# EasyEDA Pro project ProPrj_blaster_2025-02-22.epro

# Schematic Schematic1
Board Name: Board1; Create Date: 2025-02-19; Page Name: P1; Project Name: irblasterthingidk; Schematic Name: Schematic1; Update Date: 2025-02-22; Company: EasyEDA.com; Page Size: A4; Version: V1.0
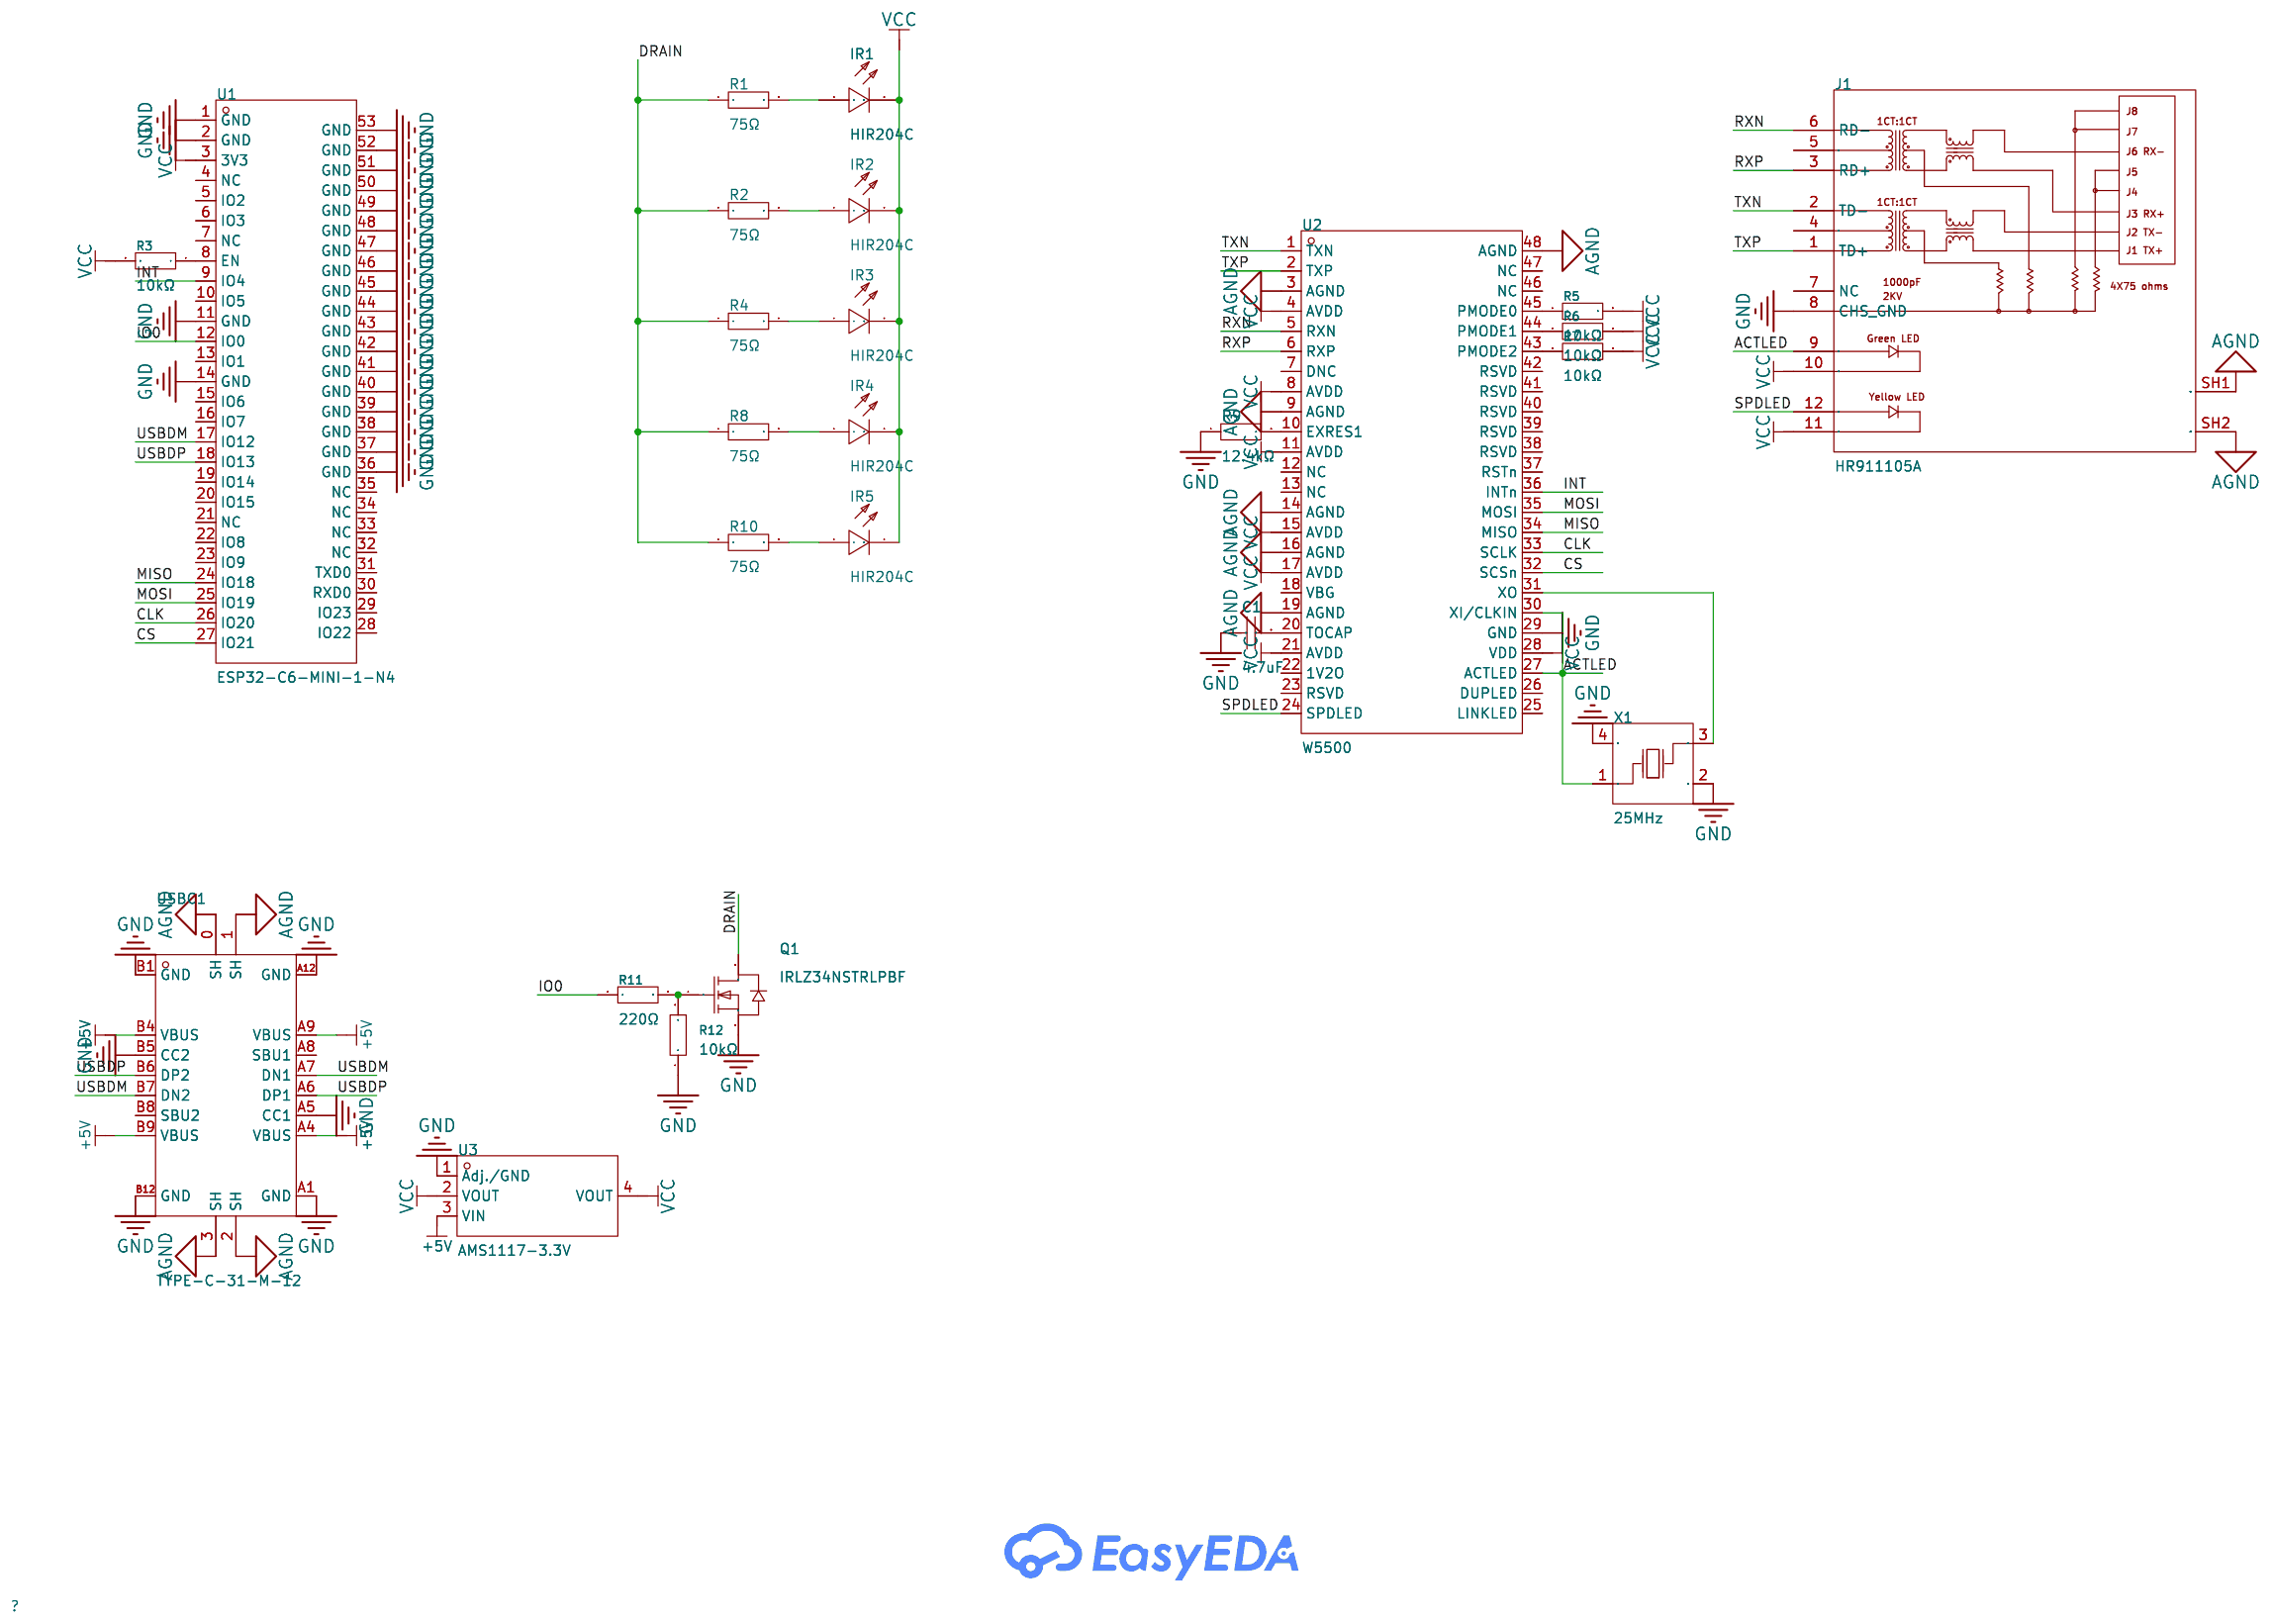
[diagram p0: schematic sheet]

## Parts
C1  4.7uF  [C0805]
IR1  HIR204C  [LED-TH_BD4.2-P2.54-FD]
IR2  HIR204C  [LED-TH_BD4.2-P2.54-FD]
IR3  HIR204C  [LED-TH_BD4.2-P2.54-FD]
IR4  HIR204C  [LED-TH_BD4.2-P2.54-FD]
IR5  HIR204C  [LED-TH_BD4.2-P2.54-FD]
J1  HR911105A  [RJ45-TH_HR911105A]
Q1  IRLZ34NSTRLPBF  [DPAK_L10.2-W9.1-P5.08-LS15.2-BL-CW]
R1  75Ω  [R0603]
R2  75Ω  [R0603]
R3  10kΩ  [R0805]
R4  75Ω  [R0603]
R5  10kΩ  [R0805]
R6  10kΩ  [R0805]
R7  10kΩ  [R0805]
R8  75Ω  [R0603]
R9  12.4kΩ  [R0603]
R10  75Ω  [R0603]
R11  220Ω  [R0603]
R12  10kΩ  [R0805]
U1  ESP32-C6-MINI-1-N4  [WIFIM-SMD_61P-L16.6-W13.2-P0.80-ESP32-C6-MINI-1-N4]
U2  W5500  [LQFP-48_L7.0-W7.0-P0.50-LS9.0-BL]
U3  AMS1117-3.3V  [SOT-223-3_L6.5-W3.4-P2.30-LS7.0-BR]
USBC1  TYPE-C-31-M-12  [USB-C_SMD-TYPE-C-31-M-12]
X1  25MHz  [CRYSTAL-SMD_4P-L3.2-W2.5-BL]

## Library data of the parts
C1 = CL21A475KAQNNNE: Capacitance: Tolerance:±10% Tolerance:±10% Voltage Rated: Temperature Coefficient:; LCSC Part Name: 4.7uF ±10% 25V; Supplier Part: C1779; Manufacturer: SAMSUNG(三星); Supplier Footprint: 0805; JLCPCB Part Class: Basic Part; Datasheet: https://atta.szlcsc.com/upload/public/pdf/source/20160218/1457707763339.pdf; Supplier: LCSC; Tolerance: ±10%
IR1-IR5 = HIR204C: Vf - Forward Voltage:1.45V Vf - Forward Voltage:1.45V Wavelength:850nm Wavelength:850nm Radiant Intensity: View Angle:25° Operating Temperature:-40℃~+85℃ Operating Temperature:-40℃~+85℃; LCSC Part Name: HIR204C 3mm 850nm R档; Supplier Part: C5118; Manufacturer: EVERLIGHT(亿光); Supplier Footprint: 插件,D=3mm; JLCPCB Part Class: Extended Part; Datasheet: https://atta.szlcsc.com/upload/public/pdf/source/20170228/1488267637610.pdf; Supplier: LCSC; Vf - Forward Voltage: 1.45V; Wavelength: 850nm; View Angle: 25°; Operating Temperature: -40℃~+85℃
J1 = HR911105A_C12074: Connector Type:RJ45Receptacle Mounting Style:- Number of Ports:1 LED:WithLED Shielding:- Ratings:- PoE:Without PoE Supplementary Features:With filtering Contact Material:- Contact Plating:- Operating Temperature Range:- Operating Temperature Range:-; LCSC Part Name: 带LED; Supplier Part: C12074; Manufacturer: HANRUN(汉仁); Supplier Footprint: 插件; JLCPCB Part Class: Extended Part; Datasheet: https://atta.szlcsc.com/upload/public/pdf/source/20170918/C12074_1505726819496976146.pdf; Supplier: LCSC; Connector Type: RJ45Receptacle; Number of Ports: 1; LED: WithLED; PoE: Without PoE; Supplementary Features: With filtering
Q1 = IRLZ34NSTRLPBF: Type:1 N-Channel Drain Source Voltage (Vdss): Continuous Drain Current (Id): Drain Source On Resistance (RDS(on)@Vgs,Id):0.035Ω@10V,16A Power Dissipation (Pd): Gate Threshold Voltage (Vgs(th)@Id):1V@250uA Total Gate Charge (Qg@Vgs):25nC Input Capacitance; LCSC Part Name: 1个N沟道 耐压:55V 电流:30A; Supplier Part: C538198; Manufacturer: Infineon(英飞凌); Supplier Footprint: D2PAk; JLCPCB Part Class: Extended Part; Datasheet: https://atta.szlcsc.com/upload/public/pdf/source/20240415/AB964699F0EAA32D992C9FC2B4E5BADE.pdf; Supplier: LCSC; Type: 1 N-Channel; Drain Source On Resistance (RDS(on)@Vgs,Id): 0.035Ω@10V,16A; Gate Threshold Voltage (Vgs(th)@Id): 1V@250uA; Total Gate Charge (Qg@Vgs): 25nC; Input Capacitance (Ciss@Vds): 880pF; Reverse Transfer Capacitance (Crss@Vds): 94pF; Operating Temperature: -55℃~+175℃
R1 R2 R4 R8 R10 = 0603WAF750JT5E: Type:Thick Film Resistors Resistance:75Ω Tolerance:±1% Tolerance:±1% Power(Watts): Overload Voltage (Max): Temperature Coefficient:±200ppm/℃ Temperature Coefficient:±200ppm/℃ Operating Temperature Range:-55℃~+155℃ Operating Temperature Range:-55℃~+155℃; LCSC Part Name: 75Ω ±1% 100mW 厚膜电阻; Supplier Part: C4275; Manufacturer: UNI-ROYAL(厚声); Supplier Footprint: 0603; JLCPCB Part Class: Basic Part; Datasheet: https://atta.szlcsc.com/upload/public/pdf/source/20200306/C422600_1E6D84923E4A46A82E41ADD87F860B5C.pdf; Supplier: LCSC; Type: Thick Film Resistors; Tolerance: ±1%; Temperature Coefficient: ±200ppm/℃; Operating Temperature Range: -55℃~+155℃
R3 R5-R7 R12 = 0805W8F1002T5E: Type:Thick Film Resistors Resistance:10kΩ Tolerance:±1% Tolerance:±1% Power(Watts): Overload Voltage (Max): Temperature Coefficient:±100ppm/℃ Temperature Coefficient:±100ppm/℃ Operating Temperature Range:-55℃~+155℃ Operating Temperature Range:-55℃~+155℃; LCSC Part Name: 10kΩ ±1% 125mW 厚膜电阻; Supplier Part: C17414; Manufacturer: UNI-ROYAL(厚声); Supplier Footprint: 0805; JLCPCB Part Class: Basic Part; Datasheet: https://atta.szlcsc.com/upload/public/pdf/source/20200306/C422600_1E6D84923E4A46A82E41ADD87F860B5C.pdf; Supplier: LCSC; Type: Thick Film Resistors; Tolerance: ±1%; Temperature Coefficient: ±100ppm/℃; Operating Temperature Range: -55℃~+155℃
R9 = 0603WAF1242T5E: Type:Thick Film Resistors Resistance:12.4kΩ Tolerance:±1% Tolerance:±1% Power(Watts): Overload Voltage (Max): Temperature Coefficient:±100ppm/℃ Temperature Coefficient:±100ppm/℃ Operating Temperature Range:-55℃~+155℃ Operating Temperature Range:-55℃~+155℃; LCSC Part Name: 12.4kΩ ±1% 100mW 厚膜电阻; Supplier Part: C22865; Manufacturer: UNI-ROYAL(厚声); Supplier Footprint: 0603; JLCPCB Part Class: Extended Part; Datasheet: https://atta.szlcsc.com/upload/public/pdf/source/20200306/C422600_1E6D84923E4A46A82E41ADD87F860B5C.pdf; Supplier: LCSC; Type: Thick Film Resistors; Tolerance: ±1%; Temperature Coefficient: ±100ppm/℃; Operating Temperature Range: -55℃~+155℃
R11 = 0603WAF2200T5E: Type:Thick Film Resistors Resistance: Tolerance:±1% Tolerance:±1% Power(Watts): Overload Voltage (Max): Temperature Coefficient:±100ppm/℃ Temperature Coefficient:±100ppm/℃ Operating Temperature Range:-55℃~+155℃ Operating Temperature Range:-55℃~+155℃; LCSC Part Name: 220Ω ±1% 100mW 厚膜电阻; Supplier Part: C22962; Manufacturer: UNI-ROYAL(厚声); Supplier Footprint: 0603; JLCPCB Part Class: Basic Part; Datasheet: https://atta.szlcsc.com/upload/public/pdf/source/20200306/C422600_1E6D84923E4A46A82E41ADD87F860B5C.pdf; Supplier: LCSC; Type: Thick Film Resistors; Tolerance: ±1%; Temperature Coefficient: ±100ppm/℃; Operating Temperature Range: -55℃~+155℃
U1 = ESP32-C6-MINI-1-N4: Supplier Part: C5736265; Manufacturer: ESPRESSIF(乐鑫); Supplier Footprint: SMD-53P; JLCPCB Part Class: Extended Part; Datasheet: https://atta.szlcsc.com/upload/public/pdf/source/20240130/4529D418EFEC832950EB8101798FAED6.pdf; Supplier: LCSC
U2 = W5500: channel:8 IO Type:SPI Supply Voltage:3.3V Supply Voltage:3.3V Supply Current:132mA Operating Temperature  range:-40℃~+85℃ Operating Temperature  range:-40℃~+85℃; LCSC Part Name: W5500硬连线TCP/IP嵌入式以太网控制器; Supplier Part: C32843; Manufacturer: WIZNET; Supplier Footprint: LQFP-48(7x7); JLCPCB Part Class: Extended Part; Datasheet: https://atta.szlcsc.com/upload/public/pdf/source/20230714/E10C32B058E0BA54FCE1C1556BE10C07.pdf; Supplier: LCSC; channel: 8; IO Type: SPI; Supply Voltage: 3.3V; Supply Current: 132mA; Operating Temperature  range: -40℃~+85℃
U3 = AMS1117-3.3V_C17702043: Output Type:Fixed Maximum Input Voltage:12V Output Voltage:3.3V Output Voltage:3.3V Output Current:1A; LCSC Part Name: 输入12V 输出3.3V 1A; Supplier Part: C17702043; Manufacturer: HXY MOSFET(华轩阳电子); Supplier Footprint: SOT-223; JLCPCB Part Class: Extended Part; Datasheet: https://atta.szlcsc.com/upload/public/pdf/source/20230912/D3384878F5C576B1BC7138E74285AA14.pdf; Supplier: LCSC; Output Type: Fixed; Maximum Input Voltage: 12V; Output Voltage: 3.3V; Output Current: 1A
USBC1 = TYPE-C-31-M-12: Connector Type:Type-C Standard:- Gender:Female Mounting Style:- Number of Contacts:16P Number of Ports:1 Current Rating - Power (Max):5A Operating Temperature Range:- Operating Temperature Range:-; LCSC Part Name: Type-C 母; Supplier Part: C165948; Manufacturer: 韩国韩荣; Supplier Footprint: SMD; JLCPCB Part Class: Extended Part; Datasheet: https://atta.szlcsc.com/upload/public/pdf/source/20220525/466408E853115E789EDB0DDC29077C05.pdf; Supplier: LCSC; Connector Type: Type-C; Gender: Female; Number of Contacts: 16P; Number of Ports: 1; Current Rating - Power (Max): 5A
X1 = X322525MOB4SI: Crystal Type:Surface Mount Crystal Frequency: Normal temperature Frequency Tolerance:±10ppm Normal temperature Frequency Tolerance:±10ppm Load Capacitor: Frequency Stability(Full temperature range):±20ppm Frequency Stability(Full temperature range):±20ppm; LCSC Part Name: 25MHz ±10ppm 12pF; Supplier Part: C9006; Manufacturer: YXC(扬兴晶振); Supplier Footprint: SMD3225-4P; JLCPCB Part Class: Basic Part; Datasheet: https://atta.szlcsc.com/upload/public/pdf/source/20240329/19D5F850207469550BEB00D7DFEDBC7A.pdf; Supplier: LCSC; Crystal Type: Surface Mount Crystal; Normal temperature Frequency Tolerance: ±10ppm; Frequency Stability(Full temperature range): ±20ppm

## Nets
+5V: U3.3(VIN) USBC1.A4(VBUS) USBC1.A9(VBUS) USBC1.B4(VBUS) USBC1.B9(VBUS)
AGND: J1.SH1 J1.SH2 U2.3(AGND) U2.9(AGND) U2.14(AGND) U2.16(AGND) U2.19(AGND) U2.48(AGND) USBC1.0(SH) USBC1.1(SH) USBC1.2(SH) USBC1.3(SH)
GND: C1.1 J1.8(CHS GND) Q1.3(S) R9.1 R12.1 U1.1(GND) U1.2(GND) U1.11(GND) U1.14(GND) U1.36(GND) U1.37(GND) U1.38(GND) U1.39(GND) U1.40(GND) U1.41(GND) U1.42(GND) U1.43(GND) U1.44(GND) U1.45(GND) U1.46(GND) U1.47(GND) U1.48(GND) U1.49(GND) U1.50(GND) U1.51(GND) U1.52(GND) U1.53(GND) U2.29(GND) U3.1(Adj./GND) USBC1.A1(GND) USBC1.A5(CC1) USBC1.A12(GND) USBC1.B1(GND) USBC1.B5(CC2) USBC1.B12(GND) X1.2(GND) X1.4(GND)
VCC: IR1.2(C) IR2.2(C) IR3.2(C) IR4.2(C) IR5.2(C) J1.10 J1.11 R3.2 R5.2 R6.2 R7.2 U1.3(3V3) U2.4(AVDD) U2.8(AVDD) U2.11(AVDD) U2.15(AVDD) U2.17(AVDD) U2.21(AVDD) U2.28(VDD) U3.2(VOUT) U3.4(VOUT)
ACTLED: J1.9 U2.27(ACTLED)
CLK: U1.26(IO20) U2.33(SCLK)
CS: U1.27(IO21) U2.32(SCSn)
DRAIN: Q1.2(D) R1.1 R2.1 R4.1 R8.1 R10.1
INT: U1.9(IO4) U2.36(INTn)
IO0: R11.1 U1.12(IO0)
MISO: U1.24(IO18) U2.34(MISO)
MOSI: U1.25(IO19) U2.35(MOSI)
RXN: J1.6(RD-) U2.5(RXN)
RXP: J1.3(RD+) U2.6(RXP)
SPDLED: J1.12 U2.24(SPDLED)
TXN: J1.2(TD-) U2.1(TXN)
TXP: J1.1(TD+) U2.2(TXP)
USBDM: U1.17(IO12) USBC1.A7(DN1) USBC1.B7(DN2)
USBDP: U1.18(IO13) USBC1.A6(DP1) USBC1.B6(DP2)
$1N1656: C1.2 U2.20(TOCAP)
$1N1729: R9.2 U2.10(EXRES1)
$1N1975: U2.31(XO) X1.3(OSC2)
$1N1980: U2.30(XI/CLKIN) X1.1(OSC1)
$1N2898: R5.1 U2.45(PMODE0)
$1N2937: R6.1 U2.44(PMODE1)
$1N2976: R7.1 U2.43(PMODE2)
$1N3133: R3.1 U1.8(EN)
$1N4218: Q1.1(G) R11.2 R12.2
$1N5126: IR1.1(A) R1.2
$1N5129: IR2.1(A) R2.2
$1N5132: IR3.1(A) R4.2
$1N5135: IR4.1(A) R8.2
$1N5138: IR5.1(A) R10.2

Not connected (* = marked no-connect by the designer): J1 4 5 7(NC); U1 4(NC) 5(IO2) 6(IO3) 7(NC) 10(IO5) 13(IO1) 15(IO6) 16(IO7) 19(IO14) 20(IO15) 21(NC) 22(IO8) 23(IO9) 28(IO22) 29(IO23) 30(RXD0) 31(TXD0) 32(NC) 33(NC) 34(NC) 35(NC); U2 7(DNC) 12(NC) 13(NC) 18(VBG) 22(1V2O) 23(RSVD) 25(LINKLED) 26(DUPLED) 37(RSTn) 38(RSVD) 39(RSVD) 40(RSVD) 41(RSVD) 42(RSVD) 46(NC) 47(NC); USBC1 A8(SBU1) B8(SBU2)

# Board PCB1
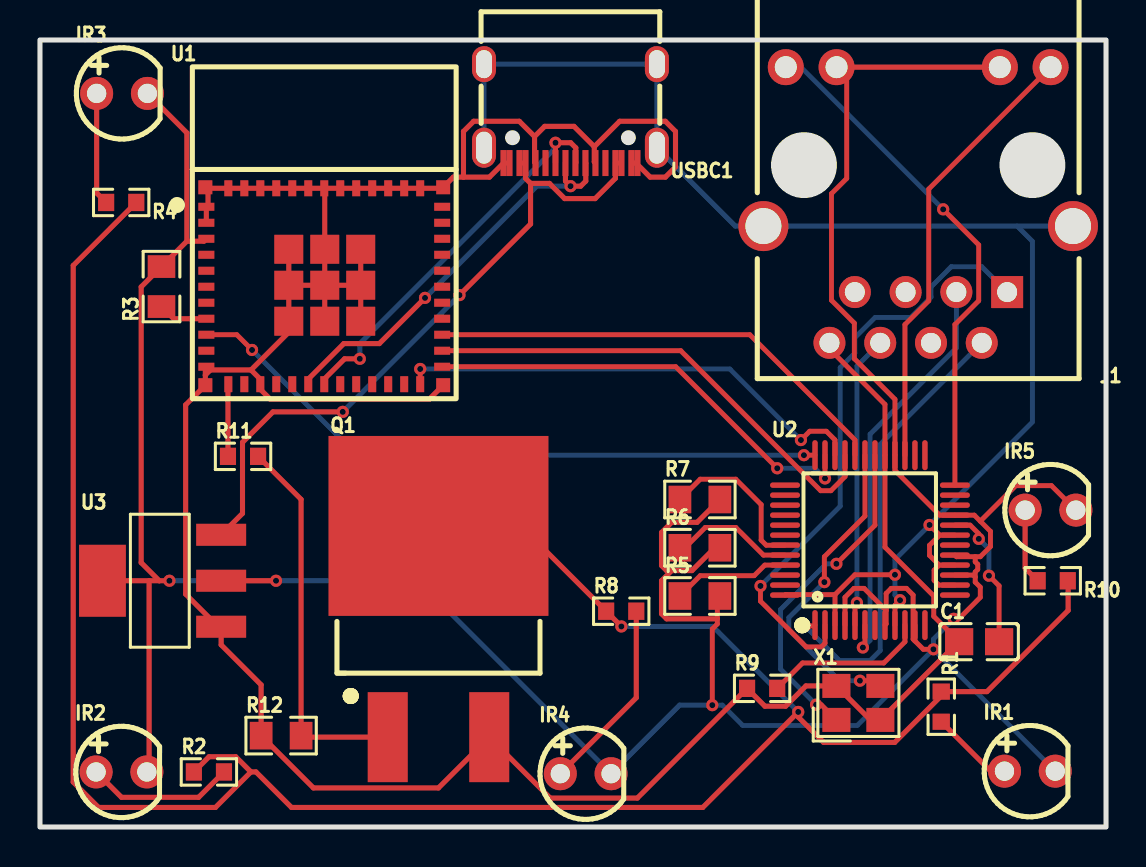
[diagram p1: board, top side]
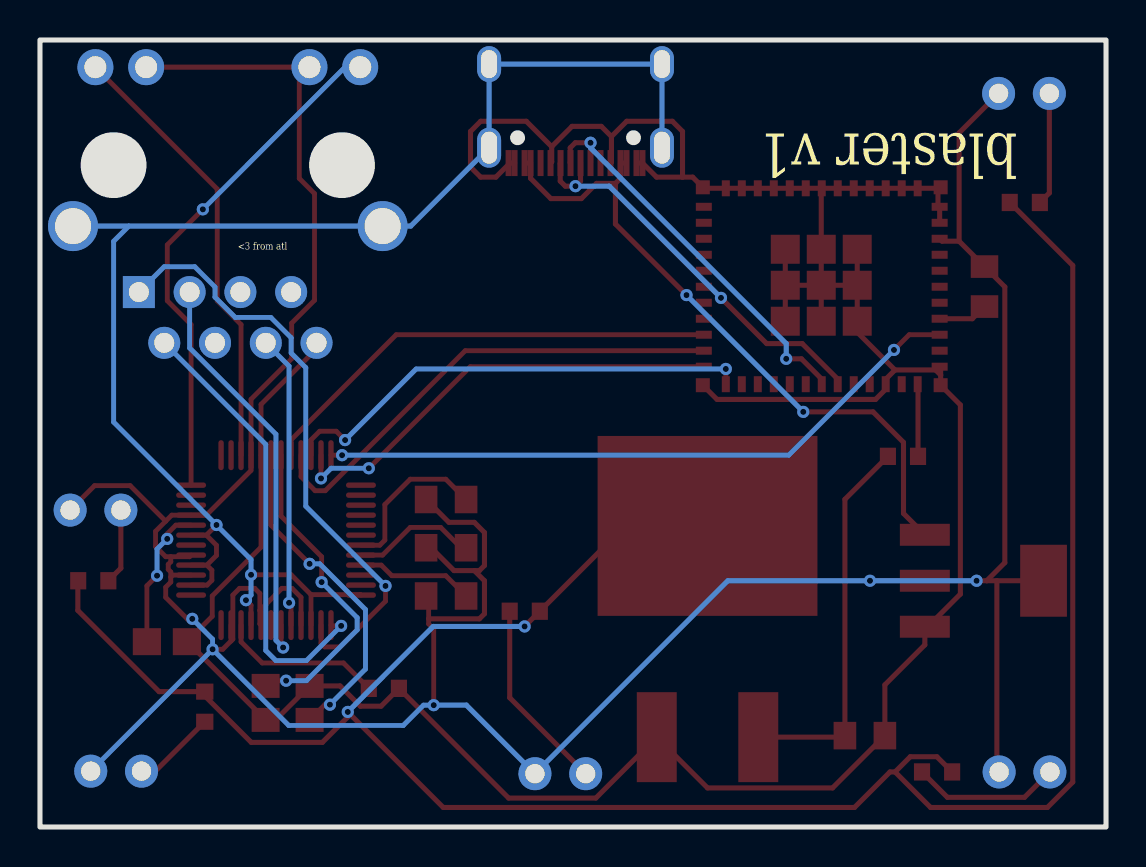
[diagram p2: board, bottom side, seen from below]

Outline 53.34 x 39.37 mm; copper layers: Top Layer, Inner1, Inner2, Bottom Layer. Coordinates in mm from the lower left corner of the outline.
Outline path: rectangle 0,39.37 53.34,0
Stack: Top Layer 0.035mm Outer layer thickness 1oz / Dielectric1 0.2104mm 7628 RC49% 8.6mil / Inner1 0.0152mm Inner layer thickness / Dielectric2 1.065mm 1.1mm H/HOZ Copper / Inner2 0.0152mm Inner layer thickness / Dielectric3 0.2104mm 7628 RC49% 8.6mil / Bottom Layer 0.035mm Outer layer thickness 1oz

## Design rules (mm)
template: JLCPCB Capability(Two Layers Board)
spacing copperThickness1oz (default): track to track 0.102, other pairs 0.152 to 0.3
spacing copperThickness2oz: track to track 0.203, other pairs 0.152 to 0.3
track width copperThickness1oz (default): min 0.127, default 0.254, max 2.54
track width copperThickness2oz: min 0.203, default 0.254, max 2.54
differential pair differentialPair (default): width min 0.127, default 0.254, max 2.54; gap min 0.152, default 0.152
via viaSize (default): diameter min 0.5, default 0.61, max 10; hole min 0.3, default 0.305, max 6.3

## Placement (name value [footprint] x y rotation side)
C1  4.7uF  [C0805]  46.99 9.27 0 top
IR1  HIR204C  [LED-TH_BD4.2-P2.54-FD]  49.53 2.79 0 top
IR2  HIR204C  [LED-TH_BD4.2-P2.54-FD]  4.08 2.75 0 top
IR3  HIR204C  [LED-TH_BD4.2-P2.54-FD]  4.11 36.7 0 top
IR4  HIR204C  [LED-TH_BD4.2-P2.54-FD]  27.3 2.67 0 top
IR5  HIR204C  [LED-TH_BD4.2-P2.54-FD]  50.56 15.85 0 top
J1  HR911105A  [RJ45-TH_HR911105A]  43.94 31.11 180 top
Q1  IRLZ34NSTRLPBF  [DPAK_L10.2-W9.1-P5.08-LS15.2-BL-CW]  19.94 9.78 0 top
R1  75Ω  [R0603]  45.1 6.02 270 top
R2  75Ω  [R0603]  8.45 2.75 0 top
R3  10kΩ  [R0805]  6.08 27.03 90 top
R4  75Ω  [R0603]  4.06 31.24 180 top
R5  10kΩ  [R0805]  33.02 11.56 0 top
R6  10kΩ  [R0805]  33.02 13.97 0 top
R7  10kΩ  [R0805]  33.02 16.38 0 top
R8  75Ω  [R0603]  29.08 10.8 0 top
R9  12.4kΩ  [R0603]  36.13 6.94 0 top
R10  75Ω  [R0603]  50.67 12.32 180 top
R11  220Ω  [R0603]  10.16 18.54 0 top
R12  10kΩ  [R0805]  12.06 4.57 0 top
U1  ESP32-C6-MINI-1-N4  [WIFIM-SMD_61P-L16.6-W13.2-P0.80-ESP32-C6-MINI-1-N4]  14.22 27.05 0 top
U2  W5500  [LQFP-48_L7.0-W7.0-P0.50-LS9.0-BL]  41.53 14.35 0 top
U3  AMS1117-3.3V  [SOT-223-3_L6.5-W3.4-P2.30-LS7.0-BR]  6.1 12.32 0 top
USBC1  TYPE-C-31-M-12  [USB-C_SMD-TYPE-C-31-M-12]  26.54 35.69 180 top
X1  25MHz  [CRYSTAL-SMD_4P-L3.2-W2.5-BL]  40.95 6.21 0 top

## Footprints (pads in the part's own frame, mm; a bottom-side part is the same pattern mirrored in y, then rotated)
C0805
  rect 1.41x1.35 smd: 1(-1,0) 2(1,0)
CRYSTAL-SMD_4P-L3.2-W2.5-BL
  rect 1.4x1.2 smd: 1(-1.1,-0.85) 2(1.1,-0.85) 3(1.1,0.85) 4(-1.1,0.85)
DPAK_L10.2-W9.1-P5.08-LS15.2-BL-CW
  rect 2x4.5 smd: 1(-2.54,-5.284) 3(2.54,-5.284)
  rect 11x9 smd: 2(0,5.284)
LED-TH_BD4.2-P2.54-FD
  round 1.651 hole 0.965: 1(-1.27,0) 2(1.27,0)
LQFP-48_L7.0-W7.0-P0.50-LS9.0-BL
  oval 0.27x1.5 smd: 1(-2.75,-4.25) 2(-2.25,-4.25) 3(-1.75,-4.25) 4(-1.25,-4.25) 5(-0.75,-4.25) 6(-0.25,-4.25) 7(0.25,-4.25) 8(0.75,-4.25) 9(1.25,-4.25) 10(1.75,-4.25) 11(2.25,-4.25) 12(2.75,-4.25) 25(2.75,4.25) 26(2.25,4.25) 27(1.75,4.25) 28(1.25,4.25) 29(0.75,4.25) 30(0.25,4.25) 31(-0.25,4.25) 32(-0.75,4.25) 33(-1.25,4.25) 34(-1.75,4.25) 35(-2.25,4.25) 36(-2.75,4.25)
  oval 1.5x0.27 smd: 13(4.25,-2.75) 14(4.25,-2.25) 15(4.25,-1.75) 16(4.25,-1.25) 17(4.25,-0.75) 18(4.25,-0.25) 19(4.25,0.25) 20(4.25,0.75) 21(4.25,1.25) 22(4.25,1.75) 23(4.25,2.25) 24(4.25,2.75) 37(-4.25,2.75) 38(-4.25,2.25) 39(-4.25,1.75) 40(-4.25,1.25) 41(-4.25,0.75) 42(-4.25,0.25) 43(-4.25,-0.25) 44(-4.25,-0.75) 45(-4.25,-1.25) 46(-4.25,-1.75) 47(-4.25,-2.25) 48(-4.25,-2.75)
R0603
  rect 0.806x0.864 smd: 1(-0.753,0) 2(0.753,0)
R0805
  rect 1.133x1.377 smd: 1(-1,0) 2(1,0)
RJ45-TH_HR911105A
  rect 1.6x1.6 hole 1: 1(-4.45,4.355)
  round 1.6 hole 1: 2(-3.18,6.895) 3(-1.91,4.355) 4(-0.64,6.895) 5(0.63,4.355) 6(1.9,6.895) 7(3.17,4.355) 8(4.44,6.895)
  round 1.8 hole 1.1: 9(-6.625,-6.895) 10(-4.085,-6.895) 11(4.085,-6.895) 12(6.625,-6.895)
  round 2.5 hole 1.8: SH1(-7.745,1.055) SH2(7.745,1.055)
SOT-223-3_L6.5-W3.4-P2.30-LS7.0-BR
  rect 2.5x1.1 smd: 1(2.97,-2.3) 2(2.97,0) 3(2.97,2.3)
  rect 2.34x3.6 smd: 4(-2.97,0)
USB-C_SMD-TYPE-C-31-M-12
  oval 1.2x2 hole 0.8x1.6: 0(-4.325,1.706) 1(4.325,1.706)
  oval 1.2x1.8 hole 0.8x1.4: 2(4.325,-2.474) 3(-4.325,-2.474)
  rect 0.3x1.3 smd: A1(-3.35,2.474) A4(-2.55,2.474) A5(-1.25,2.474) A6(-0.25,2.474) A7(0.25,2.474) A8(1.25,2.474) A9(2.55,2.474) A12(3.35,2.474) B1(3.05,2.474) B4(2.25,2.474) B5(1.75,2.474) B6(0.75,2.474) B7(-0.75,2.474) B8(-1.75,2.474) B9(-2.25,2.474) B12(-3.05,2.474)
WIFIM-SMD_61P-L16.6-W13.2-P0.80-ESP32-C6-MINI-1-N4
  rect 0.8x0.4 smd: 1(-5.9,3.975) 2(-5.9,3.175) 3(-5.9,2.375) 4(-5.9,1.575) 5(-5.9,0.775) 6(-5.9,-0.025) 7(-5.9,-0.825) 8(-5.9,-1.625) 9(-5.9,-2.425) 10(-5.9,-3.225) 11(-5.9,-4.025) 25(5.9,-4.025) 26(5.9,-3.225) 27(5.9,-2.425) 28(5.9,-1.625) 29(5.9,-0.825) 30(5.9,-0.025) 31(5.9,0.775) 32(5.9,1.575) 33(5.9,2.375) 34(5.9,3.175) 35(5.9,3.975)
  rect 0.4x0.8 smd: 12(-4.8,-4.9) 13(-4,-4.9) 14(-3.2,-4.9) 15(-2.4,-4.9) 16(-1.6,-4.9) 17(-0.8,-4.9) 18(0,-4.9) 19(0.8,-4.9) 20(1.6,-4.9) 21(2.4,-4.9) 22(3.2,-4.9) 23(4,-4.9) 24(4.8,-4.9) 36(4.8,4.9) 37(4,4.9) 38(3.2,4.9) 39(2.4,4.9) 40(1.6,4.9) 41(0.8,4.9) 42(0,4.9) 43(-0.8,4.9) 44(-1.6,4.9) 45(-2.4,4.9) 46(-3.2,4.9) 47(-4,4.9) 48(-4.8,4.9)
  rect 1.45x1.45 smd: 49(-1.775,1.85) 49(-1.775,0.05) 49(-1.775,-1.75) 49(0.025,1.85) 49(0.025,0.05) 49(0.025,-1.75) 49(1.825,1.85) 49(1.825,0.05) 49(1.825,-1.75)
  rect 0.7x0.7 smd: 50(5.95,4.95) 51(5.95,-4.95) 52(-5.95,-4.95) 53(-5.95,4.95)

## Nets
As in the schematic.

Pads without a net: J1 4 5 7; U1 4 5 6 7 10 13 15 16 19 20 21 22 23 28 29 30 31 32 33 34 35; U2 7 12 13 18 22 23 25 26 37 38 39 40 41 42 46 47; USBC1 A8 B8

## Via types
v1: diameter 0.61, hole 0.305, Top Layer to Bottom Layer, 33 vias

## Routing (per net, layer and track width the routed paths; a pad name or vN(x,y) marks a point on that pad's centre or on a via; arc(x,y) is an arc through that point)
+5V: length 33.5
  Top Layer w0.254: USBC1.A9 USBC1.B4 24.29,32.45 24.55,32.2 ; USBC1.A4 USBC1.B9 28.79,32.45 27.78,31.44 26.25,31.44 25.49,32.2 24.55,32.2 ; 24.55,32.2 24.55,30.16 v1(20.99,26.61) ; v1(15.15,20.77) 11.66,20.77 10.13,19.24 10.13,15.69 U3.3
  Bottom Layer w0.254: v1(20.99,26.61) v1(15.15,20.77)
AGND: length 76.4
  Top Layer w0.243: 39.78,11.62 U2.3 ; 39.78,11.62 40.77,12.62 v1(42.78,12.62) ; 39.78,11.62 37.3,11.62 U2.48 ; 44.99,13.1 44.74,12.85 44.74,12.34 44.98,12.1 U2.14 ; 44.99,13.1 U2.16 ; 44.99,13.1 44.51,13.58 44.51,14.09 45.02,14.6 ; 45.02,14.6 U2.19 ; 45.02,14.6 v1(44.51,15.11) ; v1(43.03,11.35) 42.78,11.09 U2.9
  Bottom Layer w0.243: 48.89,30.06 49.65,29.3 49.65,20.25 v1(44.51,15.11) 42.78,13.38 v1(42.78,12.62) 42.78,11.6 v1(43.03,11.35)
  Bottom Layer w0.254: USBC1.1 USBC1.2 USBC1.3 USBC1.0 34.79,30.06 51.69,30.06
GND: length 154.9
  Top Layer w0.243: C1.1 44.72,10.54 44.72,11.56 42.28,14 U2.29 42.28,21.14 39.5,23.92 J1.8
  Top Layer w0.254: 9.07,9.87 9.07,9.11 11.06,7.11 R12.1 13.68,1.96 19.94,1.96 Q1.3 25.53,1.45 29.89,1.45 R9.1 36.27,6.04 37.31,6.04 38.32,7.06 X1.4 41.55,5.36 X1.2 45.96,9.27 C1.1 ; 9.07,9.87 U3.1 ; 9.07,9.87 7.29,11.65 7.29,21.11 U1.52 8.27,22.61 ; 10.56,22.86 11.02,22.4 U1.14 11.02,21.9 11.53,21.39 19.46,21.39 U1.51 ; 10.56,22.86 12.45,24.75 U1.49 U1.49 ; 10.56,22.86 8.53,22.86 8.27,22.61 ; 24.75,34.54 23.98,35.3 21.7,35.3 21.19,34.8 21.19,32.51 ; 24.75,34.54 25.25,35.05 26.72,35.05 27.73,34.03 ; 24.75,34.54 24.75,33.26 USBC1.B5 ; 8.41,31.95 U1.53 ; 8.41,31.95 U1.48 U1.47 U1.46 U1.45 U1.44 U1.43 U1.42 ; 8.41,31.95 8.41,31.11 U1.1 U1.2 ; 8.27,22.61 8.27,22.98 U1.11 ; U1.49 U1.49 ; U1.49 U1.49 ; U1.49 U1.49 ; 29.83,33.21 USBC1.A1 ; 29.83,33.21 USBC1.B12 ; 29.83,33.21 30.53,32.51 31.29,32.51 31.8,33.02 31.8,34.8 31.29,35.3 29,35.3 27.73,34.03 ; U1.49 U1.49 ; U1.49 U1.49 ; U1.42 U1.41 U1.40 U1.39 U1.38 U1.37 U1.36 20.12,31.95 U1.50 20.68,32.51 21.19,32.51 ; U1.42 14.25,31.93 U1.49 U1.49 ; 21.19,32.51 22.49,32.51 USBC1.A12 USBC1.B1 ; U1.49 U1.49 ; 27.73,34.03 27.73,33.27 USBC1.A5
VCC: length 180.7
  Top Layer w0.243: 42.34,10.84 42.34,10.16 U2.8 ; 42.34,10.84 41.24,11.94 40.73,11.94 40.28,11.49 U2.4 ; 42.34,10.84 42.34,11.68 42.59,11.94 43.35,11.94 43.69,11.6 43.69,9.4 43.78,9.31 ; 43.78,9.31 U2.11 ; 43.78,9.31 44.2,8.89 v1(44.7,8.89) ; R5.2 33.89,11.43 33.89,10.16 33.64,9.91 v1(33.64,6.1) ; IR5.2 50.61,17.08 48.83,17.08 47.05,15.3 ; 47.05,15.3 46.75,15.6 U2.21 45.02,15.6 42.78,17.84 U2.28 42.78,21.39 40.75,23.43 40.75,25.2 39.6,26.35 39.6,31.68 40.36,32.44 40.36,37.5 J1.11 ; 47.05,15.3 47.56,14.79 47.56,14.03 47.05,13.52 46.8,13.52 ; 46.8,13.52 46.8,13.27 46.92,13.14 46.92,12.89 46.8,12.76 46.8,12.5 ; 46.8,13.52 45.86,13.52 U2.17 ; 46.8,12.5 46.7,12.6 U2.15 ; 46.8,12.5 46.8,12.25 47.05,12 47.05,11.49 45.97,10.41 v1(45.72,10.41)
  Top Layer w0.254: IR2.2 5.46,2.87 5.46,12.32 ; R7.2 32.88,15.24 31.61,15.24 31.1,14.73 31.1,13.08 31.35,12.83 31.61,12.83 ; 5.46,12.32 5.97,12.32 ; 5.46,12.32 U3.4 ; 7.35,29.3 8.2,29.3 U1.3 ; 7.35,29.3 7.35,34.72 IR3.2 ; 7.35,29.3 R3.2 5.06,27.02 5.06,13.22 5.97,12.32 ; 33.89,10.41 31.35,10.41 31.1,10.67 31.1,12.32 31.61,12.83 ; 5.97,12.32 v1(6.48,12.32) ; 31.61,12.83 32.62,12.83 33.64,13.84 33.89,13.84 R6.2 ; J1.11 J1.10 ; v1(11.81,12.32) U3.2
  Bottom Layer w0.243: IR1.2 v1(44.7,8.89) ; v1(44.7,8.89) 44.7,9.4 v1(45.72,10.41) ; v1(44.7,8.89) 40.89,5.08 35.16,5.08 34.15,6.1 v1(33.64,6.1)
  Bottom Layer w0.254: v1(33.64,6.1) 32,6.1 IR4.2 18.92,12.32 v1(11.81,12.32) v1(6.48,12.32)
ACTLED: length 22.4
  Top Layer w0.243: U2.27 43.28,25.13 44.47,26.33 44.47,31.91 J1.9
CLK: length 24.4
  Top Layer w0.243: 20.12,23.83 32.06,23.83 39.06,16.82 39.57,16.82 40.28,17.53 U2.33
CS: length 23.6
  Top Layer w0.243: U2.32 40.78,19.36 35.52,24.63 20.12,24.63
DRAIN: length 114.5
  Top Layer w0.254: Q1.2 24.06,15.06 R8.1 v1(29.09,10.03) ; 10.55,2.75 8.78,0.98 2.93,0.98 1.66,2.25 1.66,28.09 R4.1 ; 10.55,2.75 10.81,2.75 12.59,0.98 33.16,0.98 v1(37.94,5.76) 37.94,5.5 39.21,4.23 42.77,4.23 45.05,6.52 45.05,6.73 R1.1 47.38,6.77 51.45,10.84 51.45,12.3 R10.1 ; 10.55,2.75 9.79,3.52 8.46,3.52 R2.1
  Bottom Layer w0.254: v1(29.09,10.03) 33.66,10.03 v1(37.94,5.76)
INT: length 33
  Top Layer w0.243: 8.32,24.63 9.85,24.63 v1(10.61,23.86) ; v1(38.23,18.6) U2.36
  Bottom Layer w0.243: v1(38.23,18.6) 15.87,18.6 v1(10.61,23.86)
IO0: length 3.6
  Top Layer w0.254: U1.12 9.41,22.13 R11.1
MISO: length 24.1
  Top Layer w0.243: U2.34 39.78,19.36 39.34,19.8 38.52,19.8 v1(38.07,19.36) ; U1.24 v1(19.02,22.91)
  Bottom Layer w0.243: v1(19.02,22.91) 34.52,22.91 v1(38.07,19.36)
MOSI: length 22.6
  Top Layer w0.243: v1(36.89,17.95) 31.81,23.03 U1.25 ; v1(39.28,17.44) U2.35
  Bottom Layer w0.243: v1(36.89,17.95) 38.77,17.95 v1(39.28,17.44)
RXN: length 14.6
  Top Layer w0.243: v1(40.88,11.21) 40.78,11.12 U2.5
  Bottom Layer w0.243: J1.6 40.88,23.05 v1(40.88,11.21)
RXP: length 20.9
  Top Layer w0.243: v1(41.17,8.98) 41.28,9.08 U2.6
  Bottom Layer w0.243: J1.3 45.85,23.97 41.53,19.65 41.53,9.34 v1(41.17,8.98)
SPDLED: length 25.8
  Top Layer w0.243: U2.24 45.78,25.14 46.97,26.33 46.97,29.12 v1(45.19,30.9)
  Bottom Layer w0.243: v1(45.19,30.9) 38.08,38.01 J1.12
TXN: length 22.7
  Top Layer w0.243: v1(38.27,10.06) 38.74,10.06 U2.1
  Bottom Layer w0.243: v1(38.27,10.06) 40.01,8.32 41.53,8.32 42.04,8.83 42.04,19.14 J1.2
TXP: length 30.2
  Top Layer w0.243: U2.2 39.28,9.19 39.1,9.01 38.34,9.01 36.05,11.3 v1(36.05,12.06)
  Bottom Layer w0.243: v1(36.05,12.06) 40.04,16.05 40.04,22.98 40.77,23.71 40.77,24.47 41.79,25.49 43.57,25.49 44.58,26.51 44.58,27.01 45.6,28.03 47.12,28.03 J1.1
USBDM: length 20.4
  Top Layer w0.254: U1.17 13.42,22.41 15.2,24.18 16.98,24.18 v1(19.27,26.47) ; USBC1.B7 27.31,33.2 27.31,32.31 27.05,32.06 v1(26.55,32.06) 26.29,32.31 USBC1.A7
  Bottom Layer w0.254: v1(19.27,26.47) 24.85,32.06 v1(26.55,32.06)
USBDP: length 20.2
  Top Layer w0.254: U1.18 14.22,22.41 15.24,23.42 v1(16,23.42) ; USBC1.A6 26.81,33.23 26.81,33.97 26.56,34.23 v1(25.79,34.23) USBC1.B6
  Bottom Layer w0.254: v1(25.79,34.23) 25.79,33.97 16,24.18 v1(16,23.42)
$1N1656: length 7.2
  Top Layer w0.243: U2.20 46.54,15.1 46.97,14.67 v1(46.97,14.41) ; C1.2 47.99,12.06 v1(47.48,12.57)
  Bottom Layer w0.243: v1(46.97,14.41) 47.48,13.91 v1(47.48,12.57)
$1N1729: length 8.2
  Top Layer w0.243: U2.10 43.28,9.27 42.22,8.21 38.16,8.21 R9.2
$1N1975: length 16.1
  Top Layer w0.243: X1.3 41.79,7.32 v1(41.02,7.32) ; U2.31 41.28,15.55 39.25,13.52 v1(39.25,12.25)
  Bottom Layer w0.243: v1(39.25,12.25) 37.47,10.47 37.47,9.86 40.01,7.32 v1(41.02,7.32)
$1N1980: length 16.8
  Top Layer w0.243: X1.1 39.09,6.12 v1(38.83,6.12) ; U2.30 41.78,15.1 v1(39.85,13.17)
  Bottom Layer w0.243: v1(38.83,6.12) 37.05,7.9 37.05,10.88 39.34,13.17 v1(39.85,13.17)
$1N2898: length 5.9
  Top Layer w0.243: R5.1 33.04,12.57 35.73,12.57 36.26,13.1 U2.45
$1N2937: length 6.3
  Top Layer w0.243: R6.1 32.27,13.97 33.29,14.99 34.81,14.99 36.2,13.6 U2.44
$1N2976: length 8.1
  Top Layer w0.243: R7.1 33.04,17.4 34.81,17.4 36.08,16.13 36.08,14.35 36.34,14.1 37.27,14.1
$1N3133: length 2.5
  Top Layer w0.254: U1.8 6.69,25.43 R3.1
$1N4218: length 19.2
  Top Layer w0.254: R11.2 13.06,16.39 R12.2 13.14,4.5 Q1.1
$1N5126: length 4.2
  Top Layer w0.254: R1.2 47.57,2.79 IR1.1
$1N5129: length 7.5
  Top Layer w0.254: IR2.1 4.08,1.48 7.94,1.48 9.21,2.75
$1N5132: length 5.7
  Top Layer w0.254: IR3.1 2.84,31.72 R4.2
$1N5135: length 9.7
  Top Layer w0.254: R8.2 29.84,6.47 IR4.1
$1N5138: length 3.8
  Top Layer w0.254: IR5.1 49.29,12.95 R10.2

## Copper pours and planes (outline as drawn; the poured copper is in the pictures)
GND on Inner1: 0.63,38.99 52.83,38.99 52.83,0.38 0.63,0.38
VCC on Inner2: 0.63,38.99 52.96,38.99 52.96,0.51 0.63,0.51

## Text on the board
Bottom Silkscreen Layer: <3 from atl | blaster v1
